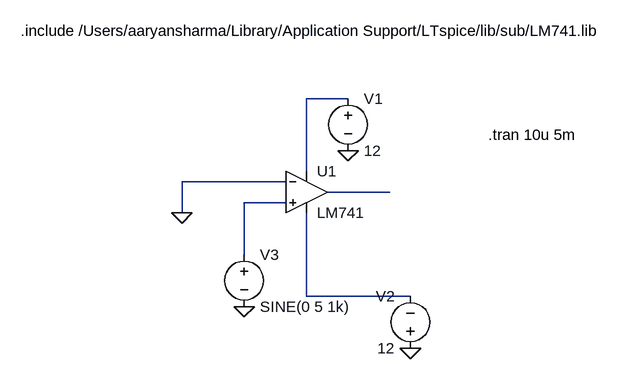
[diagram p0: schematic zeroReferenceComparator.asc]
zeroReferenceComparator.asc, the LTspice schematic file:
Version 4
SHEET 1 896 680
WIRE 480 176 416 176
WIRE 416 288 416 176
WIRE 384 304 224 304
WIRE 544 320 448 320
WIRE 384 336 320 336
WIRE 224 352 224 304
WIRE 320 416 320 336
WIRE 416 480 416 352
WIRE 576 480 416 480
FLAG 320 496 0
FLAG 224 352 0
FLAG 480 256 0
FLAG 576 560 0
SYMBOL OpAmps/opamp2 416 256 R0
SYMATTR InstName U1
SYMATTR Value LM741
SYMBOL voltage 320 400 R0
SYMATTR InstName V3
SYMATTR Value SINE(0 5 1k)
SYMBOL voltage 480 160 R0
SYMATTR InstName V1
SYMATTR Value 12
SYMBOL voltage 576 576 R180
WINDOW 0 24 96 Left 2
WINDOW 3 24 16 Left 2
SYMATTR InstName V2
SYMATTR Value 12
TEXT 696 232 Left 2 !.tran 10u 5m
TEXT -24 72 Left 2 !.include /Users/aaryansharma/Library/Application Support/LTspice/lib/sub/LM741.lib

The netlist it stands for:
* zeroReferenceComparator.asc
XU1 N003 0 N001 N004 N002 LM741  ; pins In+ In- V+ V- OUT
V3 N003 0 SINE(0 5 1k)
V1 N001 0 12
V2 0 N004 12
.tran 10u 5m
.include /Users/aaryansharma/Library/Application Support/LTspice/lib/sub/LM741.lib
.backanno
.end